# EAGLE design FinalSchematic1.0 (EAGLE 9.6.2)
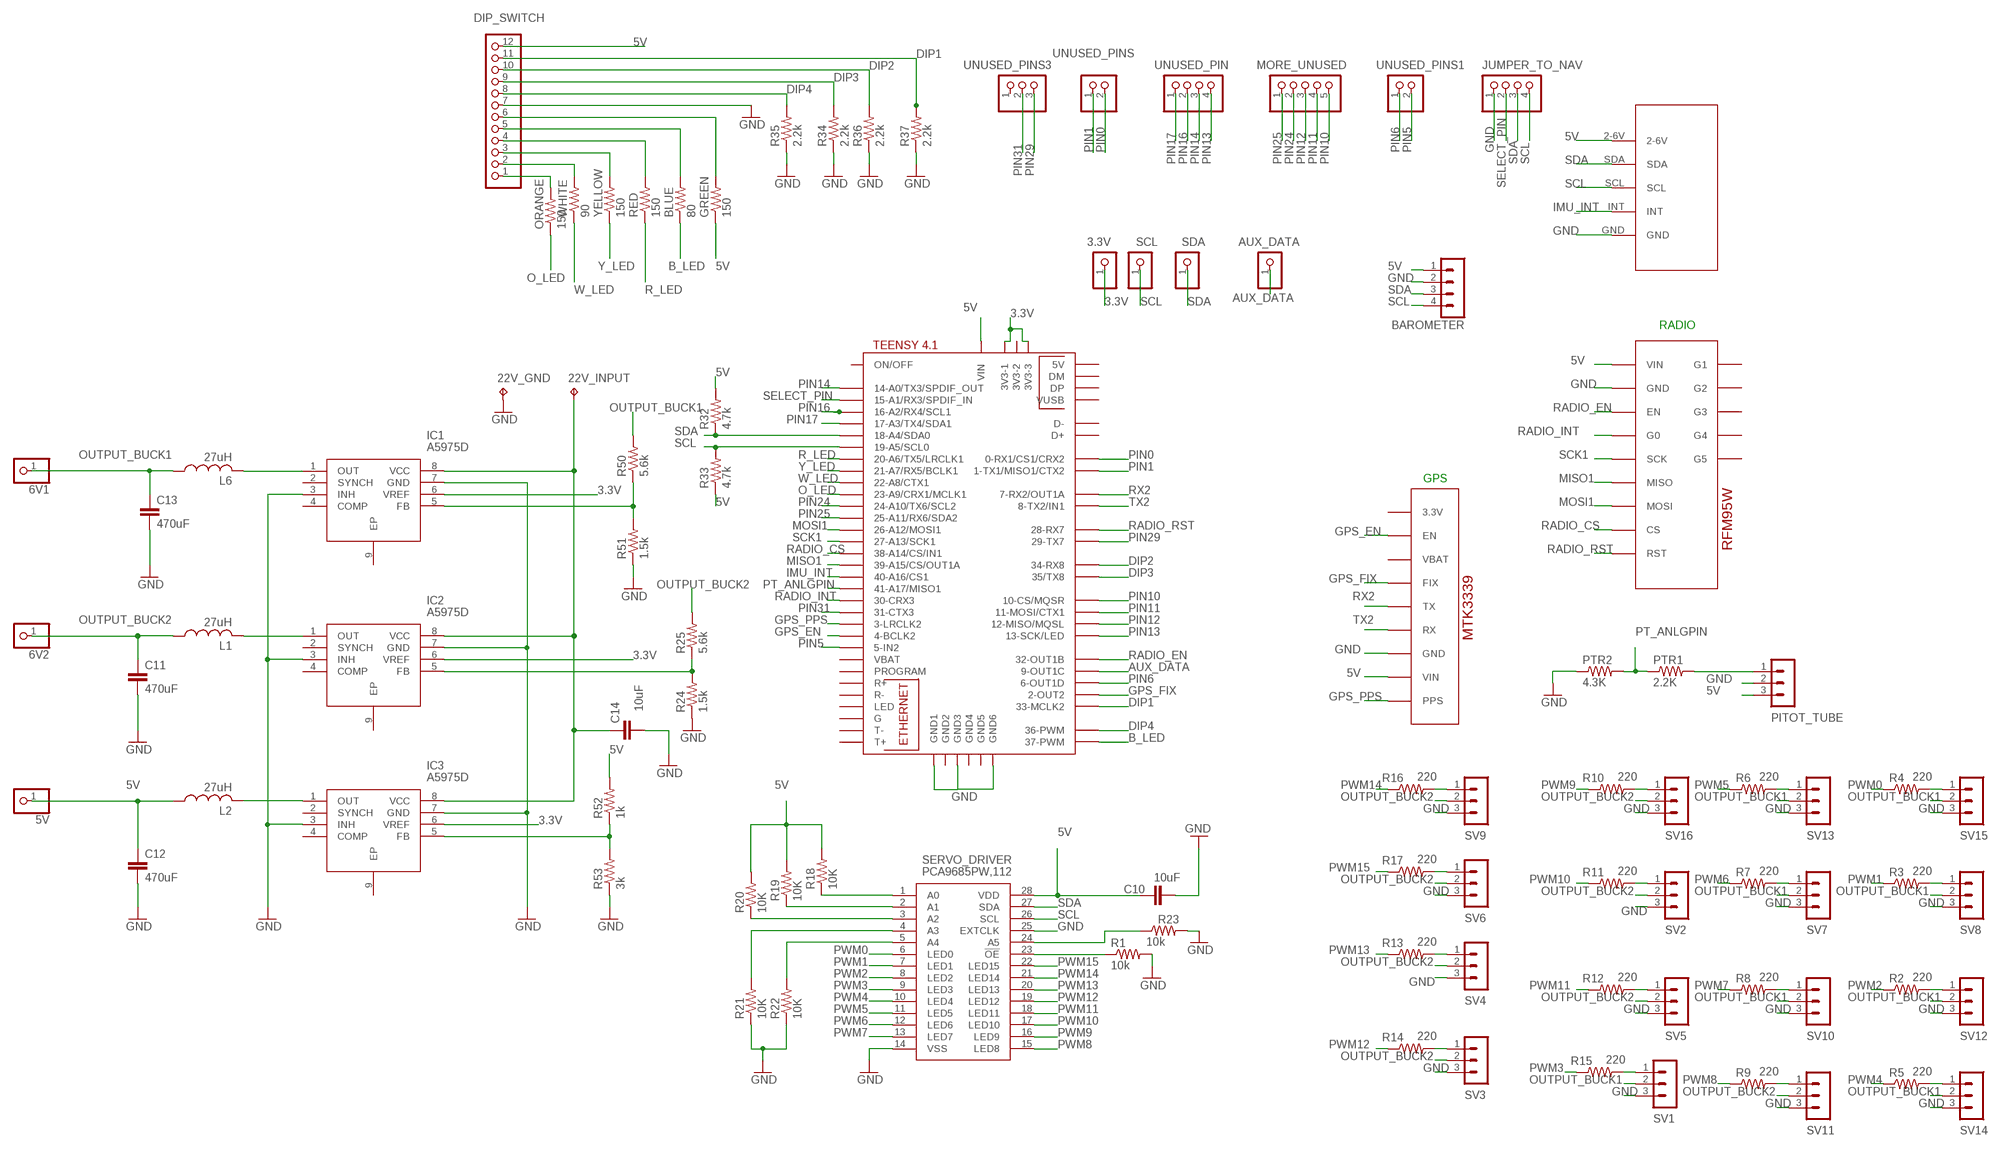
[diagram p0: schematic, sheet 1]

## Parts
3.3V  PINHD-1X1  [1X01]
5V  PINHD-1X1  [1X01]
6V1  PINHD-1X1  [1X01]
6V2  PINHD-1X1  [1X01]
22V_GND  TPPAD1-17Y  [P1-17Y]
22V_INPUT  TPPAD1-17Y  [P1-17Y]
AUX_DATA  PINHD-1X1  [1X01]
BAROMETER  MA04-1  [MA04-1]
BLUE  80  R-US_0204/7  [0204/7]
C10  10uF  C2,5-3  [C2.5-3]
C11  470uF  C2,5-3  [C2.5-3]
C12  470uF  C2,5-3  [C2.5-3]
C13  470uF  C2,5-3  [C2.5-3]
C14  10uF  C2,5-3  [C2.5-3]
DIP_SWITCH  PINHD-1X12  [1X12]
GPSMTK3339  ADAFRUIT_MTK3339_GPS  [ADAFRUIT_MTK3339_GPS]
GREEN  150  R-US_0204/7  [0204/7]
IC1  A5975D  [SOIC127P600X170-9N]
IC2  A5975D  [SOIC127P600X170-9N]
IC3  A5975D  [SOIC127P600X170-9N]
JUMPER_TO_NAV  PINHD-1X4  [1X04]
L1  27uH  L-USTFI0307  [TFI0307]
L2  27uH  L-USTFI0307  [TFI0307]
L6  27uH  L-USTFI0307  [TFI0307]
MORE_UNUSED  PINHD-1X5  [1X05]
ORANGE  150  R-US_0204/7  [0204/7]
PITOT_TUBE  MA03-1  [MA03-1]
PTR1  2.2K  R-US_0204/7  [0204/7]
PTR2  4.3K  R-US_0204/7  [0204/7]
R1  10k  R-US_0204/7  [0204/7]
R2  220  R-US_0204/7  [0204/7]
R3  220  R-US_0204/7  [0204/7]
R4  220  R-US_0204/7  [0204/7]
R5  220  R-US_0204/7  [0204/7]
R6  220  R-US_0204/7  [0204/7]
R7  220  R-US_0204/7  [0204/7]
R8  220  R-US_0204/7  [0204/7]
R9  220  R-US_0204/7  [0204/7]
R10  220  R-US_0204/7  [0204/7]
R11  220  R-US_0204/7  [0204/7]
R12  220  R-US_0204/7  [0204/7]
R13  220  R-US_0204/7  [0204/7]
R14  220  R-US_0204/7  [0204/7]
R15  220  R-US_0204/7  [0204/7]
R16  220  R-US_0204/7  [0204/7]
R17  220  R-US_0204/7  [0204/7]
R18  10K  R-US_0204/7  [0204/7]
R19  10K  R-US_0204/7  [0204/7]
R20  10K  R-US_0204/7  [0204/7]
R21  10K  R-US_0204/7  [0204/7]
R22  10K  R-US_0204/7  [0204/7]
R23  10k  R-US_0204/7  [0204/7]
R24  1.5k  R-US_0204/7  [0204/7]
R25  5.6k  R-US_0204/7  [0204/7]
R32  4.7k  R-US_0204/7  [0204/7]
R33  4.7k  R-US_0204/7  [0204/7]
R34  2.2k  R-US_0204/7  [0204/7]
R35  2.2k  R-US_0204/7  [0204/7]
R36  2.2k  R-US_0204/7  [0204/7]
R37  2.2k  R-US_0204/7  [0204/7]
R50  5.6k  R-US_0204/7  [0204/7]
R51  1.5k  R-US_0204/7  [0204/7]
R52  1k  R-US_0204/7  [0204/7]
R53  3k  R-US_0204/7  [0204/7]
RADIO  ADAFRUIT_RFM95W_LORA_RADIO  [ADAFRUIT_RFM95W_LORA_RADIO]
RED  150  R-US_0204/7  [0204/7]
SCL  PINHD-1X1  [1X01]
SDA  PINHD-1X1  [1X01]
SERVO_DRIVER  PCA9685PW,112  [SOP65P640X110-28N]
SV1  MA03-1  [MA03-1]
SV2  MA03-1  [MA03-1]
SV3  MA03-1  [MA03-1]
SV4  MA03-1  [MA03-1]
SV5  MA03-1  [MA03-1]
SV6  MA03-1  [MA03-1]
SV7  MA03-1  [MA03-1]
SV8  MA03-1  [MA03-1]
SV9  MA03-1  [MA03-1]
SV10  MA03-1  [MA03-1]
SV11  MA03-1  [MA03-1]
SV12  MA03-1  [MA03-1]
SV13  MA03-1  [MA03-1]
SV14  MA03-1  [MA03-1]
SV15  MA03-1  [MA03-1]
SV16  MA03-1  [MA03-1]
TEENSY4.1  TEENSY41  [TEENSY41]
U$2  ICM20948BREAKOUTDEVICE  [ICM20948BREAKOUT]
UNUSED_PIN  PINHD-1X4  [1X04]
UNUSED_PINS  PINHD-1X2  [1X02]
UNUSED_PINS1  PINHD-1X2  [1X02]
UNUSED_PINS3  PINHD-1X3  [1X03]
WHITE  90  R-US_0204/7  [0204/7]
YELLOW  150  R-US_0204/7  [0204/7]

## Nets
3.3V: 3.3V.1 IC1.6(VREF) IC2.6(VREF) IC3.6(VREF) TEENSY4.1.3V3-1 TEENSY4.1.3V3-3
5V: 5V.1 BAROMETER.1 C10.1 C12.1 DIP_SWITCH.12 GPSMTK3339.VIN GREEN.1 L2.1 PITOT_TUBE.3 R18.2 R19.2 R20.2 R32.2 R33.1 R52.2 RADIO.1(VIN) SERVO_DRIVER.28(VDD) TEENSY4.1.VIN U$2.2-6V
AUX_DATA: AUX_DATA.1 TEENSY4.1.9-OUT1C
B_LED: BLUE.1 TEENSY4.1.37-PWM
DIP1: DIP_SWITCH.11 R37.2 TEENSY4.1.33-MCLK2
DIP2: DIP_SWITCH.10 R36.2 TEENSY4.1.34-RX8
DIP3: DIP_SWITCH.9 R34.2 TEENSY4.1.35-TX8(35/TX8)
DIP4: DIP_SWITCH.8 R35.2 TEENSY4.1.36-PWM
GND: 22V_GND.TP BAROMETER.2 C10.2 C11.2 C12.2 C13.2 C14.2 DIP_SWITCH.7 GPSMTK3339.GND IC1.3(INH) IC1.7(GND) IC2.3(INH) IC2.7(GND) IC3.3(INH) IC3.7(GND) JUMPER_TO_NAV.1 PITOT_TUBE.2 PTR2.1 R1.2 R21.1 R22.1 R23.2 R24.1 R34.1 R35.1 R36.1 R37.1 R51.1 R53.1 RADIO.2(GND) SERVO_DRIVER.14(VSS) SERVO_DRIVER.25(EXTCLK) SV1.3 SV2.3 SV3.3 SV4.3 SV5.3 SV6.3 SV7.3 SV8.3 SV9.3 SV10.3 SV11.3 SV12.3 SV13.3 SV14.3 SV15.3 SV16.3 TEENSY4.1.GND1 TEENSY4.1.GND3 TEENSY4.1.GND6 U$2.GND
GPS_EN: GPSMTK3339.EN TEENSY4.1.4-BCLK2
GPS_FIX: GPSMTK3339.FIX TEENSY4.1.2-OUT2
GPS_PPS: GPSMTK3339.PPS TEENSY4.1.3-LRCLK2
IMU_INT: TEENSY4.1.40-A16/CS1 U$2.INT
MISO1: RADIO.6(MISO) TEENSY4.1.39-A15/CS/OUT1A
MOSI1: RADIO.7(MOSI) TEENSY4.1.26-A12/MOSI1
N$1: DIP_SWITCH.4 RED.2
N$2: R14.2 SV3.1
N$3: BLUE.2 DIP_SWITCH.5
N$4: PITOT_TUBE.1 PTR1.2
N$5: 22V_INPUT.TP C14.1 IC1.8(VCC) IC2.8(VCC) IC3.8(VCC)
N$6: IC3.1(OUT) L2.2
N$7: DIP_SWITCH.6 GREEN.2
N$8: IC1.1(OUT) L6.2
N$9: IC1.5(FB) R50.1 R51.2
N$10: DIP_SWITCH.3 YELLOW.2
N$11: DIP_SWITCH.2 WHITE.2
N$12: IC2.1(OUT) L1.2
N$14: R23.1 SERVO_DRIVER.24(A5)
N$15: R1.1 SERVO_DRIVER.23(!OE)
N$16: DIP_SWITCH.1 ORANGE.2
N$18: IC3.5(FB) R52.1 R53.2
N$19: IC2.5(FB) R24.2 R25.1
N$43: R10.2 SV16.1
N$72: R22.2 SERVO_DRIVER.5(A4)
N$73: R21.2 SERVO_DRIVER.4(A3)
N$74: R20.1 SERVO_DRIVER.3(A2)
N$75: R19.1 SERVO_DRIVER.2(A1)
N$76: R18.1 SERVO_DRIVER.1(A0)
N$81: R6.2 SV13.1
N$82: R4.2 SV15.1
N$85: R3.2 SV8.1
N$88: R7.2 SV7.1
N$91: R11.2 SV2.1
N$94: R15.2 SV1.1
N$97: R2.2 SV12.1
N$100: R5.2 SV14.1
N$105: R9.2 SV11.1
N$108: R8.2 SV10.1
N$109: R12.2 SV5.1
N$112: R16.2 SV9.1
N$115: R17.2 SV6.1
N$118: R13.2 SV4.1
O_LED: ORANGE.1 TEENSY4.1.23-A9/CRX1/MCLK1
OUTPUT_BUCK1: 6V1.1 C13.1 L6.1 R50.2 SV1.2 SV7.2 SV8.2 SV10.2 SV12.2 SV13.2 SV14.2 SV15.2
OUTPUT_BUCK2: 6V2.1 C11.1 L1.1 R25.2 SV2.2 SV3.2 SV4.2 SV5.2 SV6.2 SV9.2 SV11.2 SV16.2
PIN0: TEENSY4.1.0-RX1/CS1/CRX2 UNUSED_PINS.2
PIN1: TEENSY4.1.1-TX1/MISO1/CTX2 UNUSED_PINS.1
PIN5: TEENSY4.1.5-IN2 UNUSED_PINS1.2
PIN6: TEENSY4.1.6-OUT1D UNUSED_PINS1.1
PIN10: MORE_UNUSED.5 TEENSY4.1.10-CS\MQSR(10-CS/MQSR)
PIN11: MORE_UNUSED.4 TEENSY4.1.11-MOSI/CTX1
PIN12: MORE_UNUSED.3 TEENSY4.1.12-MISO/MQSL
PIN13: TEENSY4.1.13-SCK/LED UNUSED_PIN.4
PIN14: TEENSY4.1.14-A0/TX3/SPDIF_OUT UNUSED_PIN.3
PIN16: TEENSY4.1.16-A2/RX4/SCL1 UNUSED_PIN.2
PIN17: TEENSY4.1.17-A3/TX4/SDA1 UNUSED_PIN.1
PIN24: MORE_UNUSED.2 TEENSY4.1.24-A10/TX6/SCL2
PIN25: MORE_UNUSED.1 TEENSY4.1.25-A11/RX6/SDA2
PIN29: TEENSY4.1.29-TX7 UNUSED_PINS3.3
PIN31: TEENSY4.1.31-CTX3 UNUSED_PINS3.2
PT_ANLGPIN: PTR1.1 PTR2.2 TEENSY4.1.41-A17/MISO1
PWM0: R4.1 SERVO_DRIVER.6(LED0)
PWM1: R3.1 SERVO_DRIVER.7(LED1)
PWM2: R2.1 SERVO_DRIVER.8(LED2)
PWM3: R15.1 SERVO_DRIVER.9(LED3)
PWM4: R5.1 SERVO_DRIVER.10(LED4)
PWM5: R6.1 SERVO_DRIVER.11(LED5)
PWM6: R7.1 SERVO_DRIVER.12(LED6)
PWM7: R8.1 SERVO_DRIVER.13(LED7)
PWM8: R9.1 SERVO_DRIVER.15(LED8)
PWM9: R10.1 SERVO_DRIVER.16(LED9)
PWM10: R11.1 SERVO_DRIVER.17(LED10)
PWM11: R12.1 SERVO_DRIVER.18(LED11)
PWM12: R14.1 SERVO_DRIVER.19(LED12)
PWM13: R13.1 SERVO_DRIVER.20(LED13)
PWM14: R16.1 SERVO_DRIVER.21(LED14)
PWM15: R17.1 SERVO_DRIVER.22(LED15)
R_LED: RED.1 TEENSY4.1.20-A6/TX5/LRCLK1
RADIO_CS: RADIO.8(CS) TEENSY4.1.38-A14/CS/IN1
RADIO_EN: RADIO.3(EN) TEENSY4.1.32-OUT1B
RADIO_INT: RADIO.4(G0) TEENSY4.1.30-CRX3
RADIO_RST: RADIO.9(RST) TEENSY4.1.28-RX7
RX2: GPSMTK3339.TX TEENSY4.1.7-RX2/OUT1A
SCK1: RADIO.5(SCK) TEENSY4.1.27-A13/SCK1
SCL: BAROMETER.4 JUMPER_TO_NAV.4 R33.2 SCL.1 SERVO_DRIVER.26(SCL) TEENSY4.1.19-A5/SCL0 U$2.SCL
SDA: BAROMETER.3 JUMPER_TO_NAV.3 R32.1 SDA.1 SERVO_DRIVER.27(SDA) TEENSY4.1.18-A4/SDA0 U$2.SDA
SELECT_PIN: JUMPER_TO_NAV.2 TEENSY4.1.15-A1/RX3/SPDIF_IN
TX2: GPSMTK3339.RX TEENSY4.1.8-TX2/IN1
W_LED: TEENSY4.1.22-A8/CTX1 WHITE.1
Y_LED: TEENSY4.1.21-A7/RX5/BCLK1 YELLOW.1
Unconnected: GPSMTK3339.3.3V GPSMTK3339.VBAT IC1.2(SYNCH) IC1.4(COMP) IC1.9(EP) IC2.2(SYNCH) IC2.4(COMP) IC2.9(EP) IC3.2(SYNCH) IC3.4(COMP) IC3.9(EP) RADIO.10(G1) RADIO.11(G2) RADIO.12(G3) RADIO.13(G4) RADIO.14(G5) TEENSY4.1.3V3-2 TEENSY4.1.+5V(5V) TEENSY4.1.D+ TEENSY4.1.D- TEENSY4.1.DM TEENSY4.1.DP TEENSY4.1.G TEENSY4.1.GND2 TEENSY4.1.GND4 TEENSY4.1.GND5 TEENSY4.1.LED TEENSY4.1.ON/OFF TEENSY4.1.PROGRAM TEENSY4.1.R+ TEENSY4.1.R- TEENSY4.1.T+ TEENSY4.1.T- TEENSY4.1.VBAT TEENSY4.1.VUSB UNUSED_PINS3.1

## Notes on the sheet
- RADIO
- GPS

## Library data of the parts
3.3V 5V 6V1 6V2 AUX_DATA SCL SDA = pinhead:PINHD-1X1: PIN HEADER
22V_GND 22V_INPUT = testpad:TP: Test pad
BAROMETER = con-lstb:MA04-1: PIN HEADER; OC_FARNELL: unknown; OC_NEWARK: unknown
BLUE GREEN ORANGE PTR1 PTR2 R1-R25 R32-R37 R50-R53 RED WHITE YELLOW = adafruit:R-US_: RESISTOR, American symbol
C10-C14 = capacitor-wima:C: CAPACITOR naming: grid - package width
DIP_SWITCH = pinhead:PINHD-1X12: PIN HEADER
GPSMTK3339 = AERO_Eagle_Library:ADAFRUIT_MTK3339_GPS: Adafruit's Ultimate GPS Breakout: MTK3339 https://www.adafruit.com/product/746
IC1-IC3 = A5975D:A5975D: STMICROELECTRONICS - A5975D - DC/DC Boost Regulator, Adjustable, AEC-Q100, 4V to 36V In, 1.235V to 35V/3A Out, 250 kHz, PowerSO-8 Source: Datasheet <https://www.st.com/resource/en/datasheet/a5975d.pdf>; ARROW_PART_NUMBER: A5975D; ARROW_PRICE-STOCK: https://www.arrow.com/en/products/a5975d/stmicroelectronics; DESCRIPTION: STMICROELECTRONICS - A5975D - DC/DC Boost Regulator, Adjustable, AEC-Q100, 4V to 36V In, 1.235V to 35V/3A Out, 250 kHz, PowerSO-8; HEIGHT: 1.7mm; MANUFACTURER_NAME: STMicroelectronics; MANUFACTURER_PART_NUMBER: A5975D; MOUSER_PART_NUMBER: 511-A5975D; MOUSER_PRICE-STOCK: https://www.mouser.co.uk/ProductDetail/STMicroelectronics/A5975D?qs=LYO3r17CQdO66PebjUe%2FOA%3D%3D
JUMPER_TO_NAV UNUSED_PIN = pinhead:PINHD-1X4: PIN HEADER
L1 L2 L6 = rcl:L-US: INDUCTOR, American symbol; SPICEPREFIX: L
MORE_UNUSED = pinhead:PINHD-1X5: PIN HEADER
PITOT_TUBE SV1-SV16 = con-lstb:MA03-1: PIN HEADER; OC_FARNELL: unknown; OC_NEWARK: unknown
RADIO = AERO_Eagle_Library:ADAFRUIT_RFM95W_LORA_RADIO: Adafruit's LoRa Radio: RFM95W https://www.adafruit.com/product/3072
SERVO_DRIVER = PCA9685PW_112:PCA9685PW,112: 16-channel, 12-bit PWM Fm+ I2C-bus LED controller Source: Datasheet <http://www.nxp.com/docs/en/data-sheet/PCA9685.pdf>; ARROW_PART_NUMBER: PCA9685PW,112; ARROW_PRICE-STOCK: https://www.arrow.com/en/products/pca9685pw112/nxp-semiconductors; DESCRIPTION: 16-channel, 12-bit PWM Fm+ I2C-bus LED controller; HEIGHT: 1.1mm; MANUFACTURER_NAME: NXP; MANUFACTURER_PART_NUMBER: PCA9685PW,112; MOUSER_PART_NUMBER: 771-PCA9685PW,112; MOUSER_PRICE-STOCK: https://www.mouser.co.uk/ProductDetail/NXP-Semiconductors/PCA9685PW112/?qs=6YAT8rHPFU9wZqiAeiOMZw%3D%3D
TEENSY4.1 = teensy:TEENSY41
U$2 = ICM20948 BREAKOUT:ICM20948BREAKOUTDEVICE
UNUSED_PINS UNUSED_PINS1 = pinhead:PINHD-1X2: PIN HEADER
UNUSED_PINS3 = pinhead:PINHD-1X3: PIN HEADER

## Board
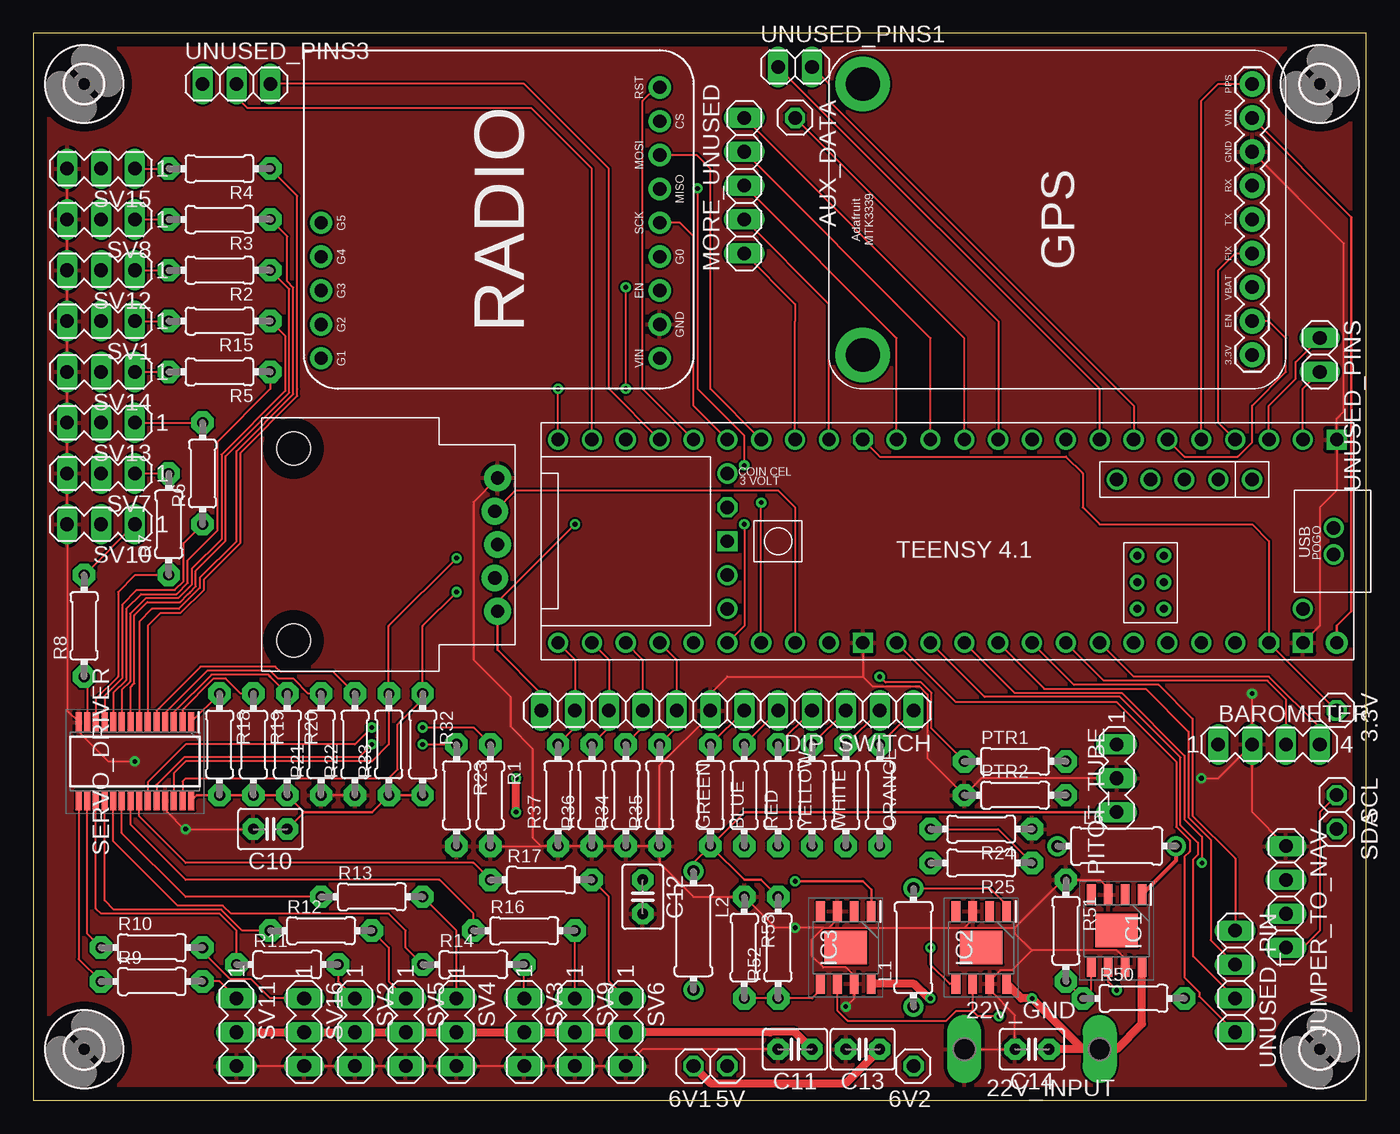
[diagram p1: board, top side]
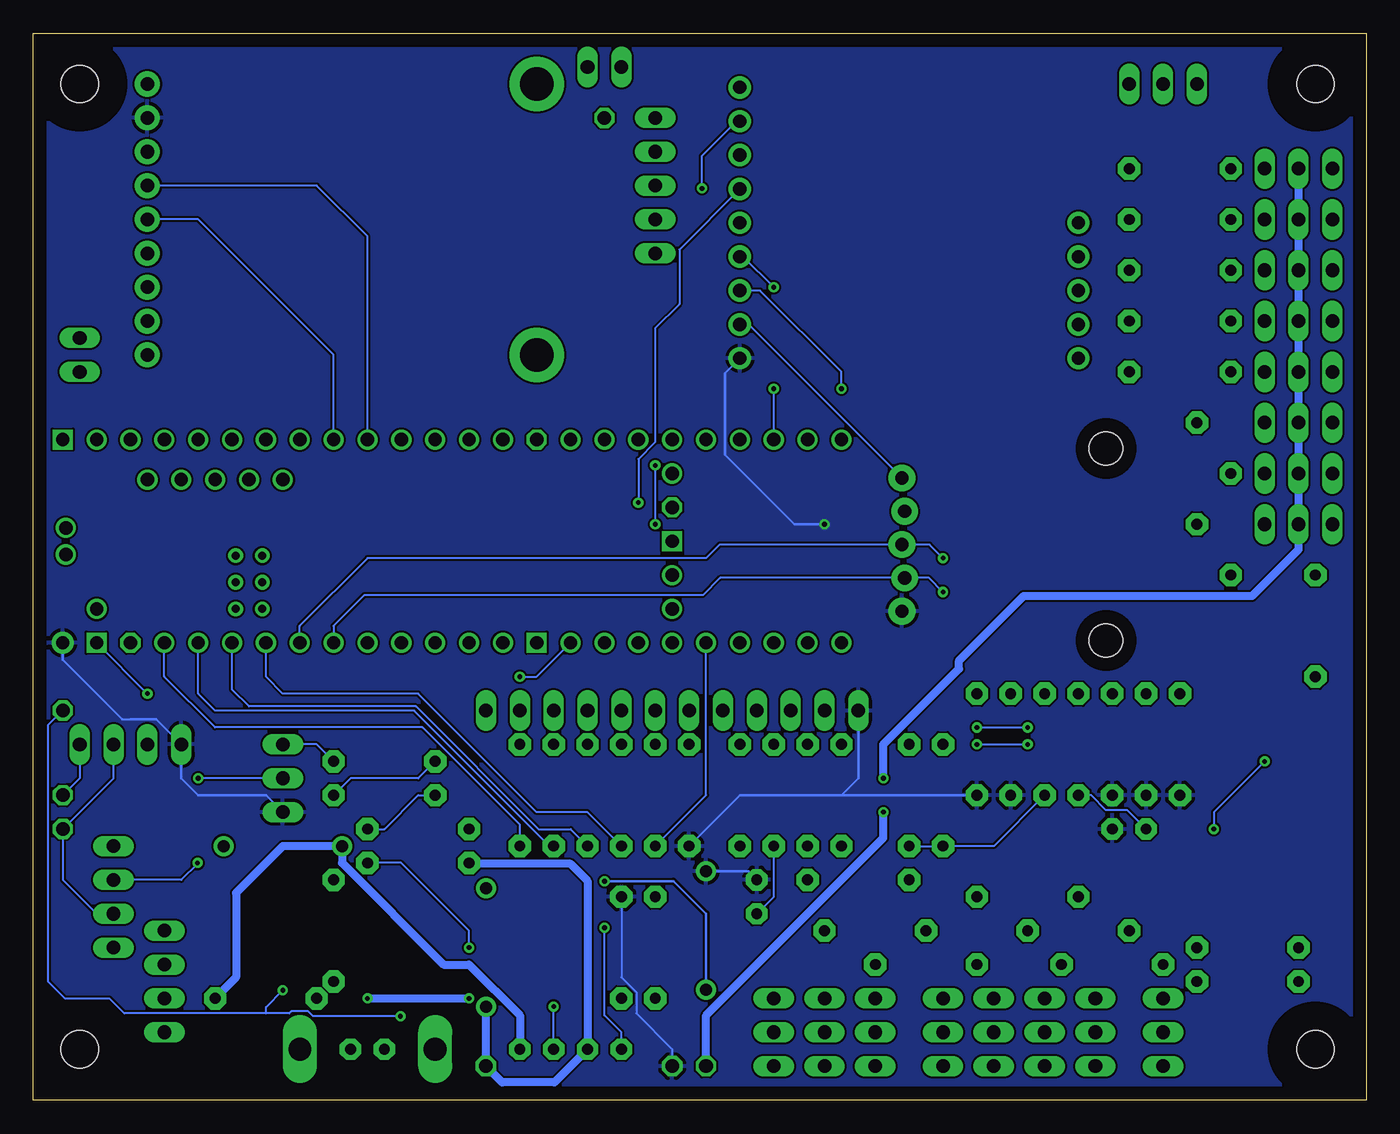
[diagram p2: board, bottom side, seen from below]

Size 100 x 80 mm. Coordinates in mm from the lower left corner, seen from the top.
Outline: 0,0 100,0 100,80 0,80 0,0
Copper layers (1*16): Top 0.035mm / dielectric 1.5mm / Bottom 0.035mm
Design rules "default *": minimum track width 6mil, minimum drill 0.35mm, track to track 6mil, track to pad 8mil, pad to pad 6mil, via to via 8mil, smd to smd 6mil, copper to edge 40mil, drill to drill 6mil, minimum pad ring 10mil, minimum via ring 8mil, stop-mask expansion 4mil, vias tented up to drill 0mil, thermal gap 10mil

### Footprints (pad centres in the part's own frame; a part is rotated, then mirrored left to right if it is on the bottom)
1X01 = drill 1.016 octagon: 1 0,0
P1-17Y = drill 1.702 pad 2.121 long: TP 0,0
MA04-1 = drill 1.016 long: 1 -3.81,0; 2 -1.27,0; 3 1.27,0; 4 3.81,0
0204/7 = drill 0.813 pad 1.676 octagon: 1 -3.81,0; 2 3.81,0
C2.5-3 = drill 0.813 pad 1.6 octagon: 1 -1.27,0; 2 1.27,0
1X12 = drill 1.016 long: 1 -13.97,0; 2 -11.43,0; 3 -8.89,0; 4 -6.35,0; 5 -3.81,0; 6 -1.27,0; 7 1.27,0; 8 3.81,0; 9 6.35,0; 10 8.89,0; 11 11.43,0; 12 13.97,0
ADAFRUIT_MTK3339_GPS = drill 1.016 pad 1.88: 3.3V 2.54,2.54; EN 5.08,2.54; FIX 10.16,2.54; GND 17.78,2.54; PPS 22.86,2.54; RX 15.24,2.54; TX 12.7,2.54; VBAT 7.62,2.54; VIN 20.32,2.54 | drill 2.54 pad 4.064: P$1 22.86,31.75; P$2 2.54,31.75
SOIC127P600X170-9N = smd 1.525 x 0.65: 1 -2.712,1.905; 2 -2.712,0.635; 3 -2.712,-0.635; 4 -2.712,-1.905; 5 2.712,-1.905; 6 2.712,-0.635; 7 2.712,0.635; 8 2.712,1.905 | smd 2.51 x 3.2: 9 0,0
1X04 = drill 1.016 long: 1 -3.81,0; 2 -1.27,0; 3 1.27,0; 4 3.81,0
TFI0307 = drill 0.9 pad 1.5: 1 -4.445,0; 2 4.445,0
1X05 = drill 1.016 long: 1 -5.08,0; 2 -2.54,0; 3 0,0; 4 2.54,0; 5 5.08,0
MA03-1 = drill 1.016 long: 1 -2.54,0; 2 0,0; 3 2.54,0
ADAFRUIT_RFM95W_LORA_RADIO = drill 1 pad 1.676: 1 2.29,-26.67; 2 4.83,-26.67; 3 7.37,-26.67; 4 9.91,-26.67; 5 12.45,-26.67; 6 14.99,-26.67; 7 17.53,-26.67; 8 20.07,-26.67; 9 22.61,-26.67; 10 2.29,-1.27; 11 4.83,-1.27; 12 7.37,-1.27; 13 9.91,-1.27; 14 12.45,-1.27
SOP65P640X110-28N = smd 1.475 x 0.45: 1 -2.938,4.225; 2 -2.938,3.575; 3 -2.938,2.925; 4 -2.938,2.275; 5 -2.938,1.625; 6 -2.938,0.975; 7 -2.938,0.325; 8 -2.938,-0.325; 9 -2.938,-0.975; 10 -2.938,-1.625; 11 -2.938,-2.275; 12 -2.938,-2.925; 13 -2.938,-3.575; 14 -2.938,-4.225; 15 2.938,-4.225; 16 2.938,-3.575; 17 2.938,-2.925; 18 2.938,-2.275; 19 2.938,-1.625; 20 2.938,-0.975; 21 2.938,-0.325; 22 2.938,0.325; 23 2.938,0.975; 24 2.938,1.625; 25 2.938,2.275; 26 2.938,2.925; 27 2.938,3.575; 28 2.938,4.225
TEENSY41 = drill 1: 0-RX1/CS1/CRX2 -27.94,-7.62; 1-TX1/MISO1/CTX2 -25.4,-7.62; 2-OUT2 -22.86,-7.62; 3-LRCLK2 -20.32,-7.62; 4-BCLK2 -17.78,-7.62; 5-IN2 -15.24,-7.62; 6-OUT1D -12.7,-7.62; 7-RX2/OUT1A -10.16,-7.62; 8-TX2/IN1 -7.62,-7.62; 9-OUT1C -5.08,-7.62; 10-CS\MQSR -2.54,-7.62; 11-MOSI/CTX1 0,-7.62; 12-MISO/MQSL 2.54,-7.62; 13-SCK/LED 2.54,7.62; 14-A0/TX3/SPDIF_OUT 0,7.62; 15-A1/RX3/SPDIF_IN -2.54,7.62; 16-A2/RX4/SCL1 -5.08,7.62; 17-A3/TX4/SDA1 -7.62,7.62; 18-A4/SDA0 -10.16,7.62; 19-A5/SCL0 -12.7,7.62; 20-A6/TX5/LRCLK1 -15.24,7.62; 21-A7/RX5/BCLK1 -17.78,7.62; 22-A8/CTX1 -20.32,7.62; 23-A9/CRX1/MCLK1 -22.86,7.62; 24-A10/TX6/SCL2 7.62,-7.62; 25-A11/RX6/SDA2 10.16,-7.62; 26-A12/MOSI1 12.7,-7.62; 27-A13/SCK1 15.24,-7.62; 28-RX7 17.78,-7.62; 29-TX7 20.32,-7.62; 30-CRX3 22.86,-7.62; 31-CTX3 25.4,-7.62; 32-OUT1B 27.94,-7.62; 33-MCLK2 27.94,7.62; 34-RX8 25.4,7.62; 35-TX8 22.86,7.62; 36-PWM 20.32,7.62; 37-PWM 17.78,7.62; 38-A14/CS/IN1 15.24,7.62; 39-A15/CS/OUT1A 12.7,7.62; 40-A16/CS1 10.16,7.62; 41-A17/MISO1 7.62,7.62; +5V -24.13,-4.62; D+ -30.25,-1; D- -30.25,1; DM -21.59,-4.62; DP -19.05,-4.62; GND4 -16.51,-4.62; GND5 -13.97,-4.62; ON/OFF 15.24,5.08; PROGRAM 15.24,2.54; VBAT 15.24,-5.08; VUSB -27.94,5.08 | drill 1 octagon: 3V3-1 5.08,-7.62; 3V3-2 15.24,-2.54; 3V3-3 -25.4,7.62 | drill 0.6: G -15.51,3.08; LED -17.51,3.08; R+ -17.51,5.08; R- -15.51,5.08; T+ -15.51,1.08; T- -17.51,1.08 | drill 1 square: GND1 -30.48,-7.62; GND2 15.24,0; GND3 5.08,7.62; GND6 -27.94,7.62 | drill 1 pad 1.676: VIN -30.48,7.62
2,8 = hole 2.8: 0,0
ICM20948BREAKOUT = drill 1 pad 2: 2-6V -5.254,-9.427; GND 4.746,-9.427; INT 2.246,-9.227; SCL -0.254,-9.427; SDA -2.754,-9.227 | hole 2.5: -7.454,5.873; 6.946,5.873
1X02 = drill 1.016 long: 1 -1.27,0; 2 1.27,0
1X03 = drill 1.016 long: 1 -2.54,0; 2 0,0; 3 2.54,0

### Placement (x,y rotation side)
3.3V  97.79,29.21 270 top
5V  52.07,2.54 180 top
6V1  49.53,2.54 180 top
6V2  66.04,2.54 180 top
22V_GND  69.85,3.81 0 top
22V_INPUT  80.01,3.81 180 top
AUX_DATA  57.15,73.66 270 top
BAROMETER  92.71,26.67 0 top
BLUE  53.34,22.86 90 top
C10  17.78,20.32 180 top
C11  57.15,3.81 180 top
C12  45.72,15.24 270 top
C13  62.23,3.81 180 top
C14  74.93,3.81 180 top
DIP_SWITCH  52.07,29.21 180 top
GPSMTK3339  93.98,53.34 90 top
GREEN  50.8,22.86 90 top
IC1  81.28,12.7 270 top
IC2  71.12,11.43 270 top
IC3  60.96,11.43 270 top
JUMPER_TO_NAV  93.98,15.24 270 top
L1  66.04,11.43 90 top
L2  49.53,12.7 270 top
L6  81.28,19.05 0 top
MORE_UNUSED  53.34,68.58 90 top
ORANGE  63.5,22.86 90 top
PITOT_TUBE  81.28,24.13 270 top
PTR1  73.66,25.4 0 top
PTR2  73.66,22.86 0 top
R1  34.29,22.86 270 top
R2  13.97,62.23 180 top
R3  13.97,66.04 180 top
R4  13.97,69.85 180 top
R5  13.97,54.61 180 top
R6  12.7,46.99 90 top
R7  10.16,43.18 90 top
R8  3.81,35.56 90 top
R9  8.89,8.89 0 top
R10  8.89,11.43 0 top
R11  19.05,10.16 0 top
R12  21.59,12.7 0 top
R13  25.4,15.24 0 top
R14  33.02,10.16 0 top
R15  13.97,58.42 180 top
R16  36.83,12.7 0 top
R17  38.1,16.51 0 top
R18  13.97,26.67 270 top
R19  16.51,26.67 270 top
R20  19.05,26.67 270 top
R21  21.59,26.67 90 top
R22  24.13,26.67 90 top
R23  31.75,22.86 270 top
R24  71.12,20.32 180 top
R25  71.12,17.78 180 top
R32  29.21,26.67 270 top
R33  26.67,26.67 90 top
R34  44.45,22.86 90 top
R35  46.99,22.86 90 top
R36  41.91,22.86 90 top
R37  39.37,22.86 90 top
R50  82.55,7.62 0 top
R51  77.47,12.7 270 top
R52  55.88,11.43 90 top
R53  53.34,11.43 270 top
RADIO  20.32,53.34 90 top
RED  55.88,22.86 90 top
SCL  97.79,22.86 270 top
SDA  97.79,20.32 270 top
SERVO_DRIVER  7.62,25.4 270 top
SV1  5.08,58.42 180 top
SV2  24.13,5.08 270 top
SV3  36.83,5.08 270 top
SV4  31.75,5.08 270 top
SV5  27.94,5.08 270 top
SV6  44.45,5.08 270 top
SV7  5.08,46.99 180 top
SV8  5.08,66.04 180 top
SV9  40.64,5.08 270 top
SV10  5.08,43.18 180 top
SV11  15.24,5.08 270 top
SV12  5.08,62.23 180 top
SV13  5.08,50.8 180 top
SV14  5.08,54.61 180 top
SV15  5.08,69.85 180 top
SV16  20.32,5.08 270 top
TEENSY4.1  67.31,41.91 180 top
U$1  [2,8]  3.81,76.2 0 top
U$2  25.4,41.91 90 top
U$3  [2,8]  96.52,76.2 0 top
U$4  [2,8]  3.81,3.81 0 top
U$5  [2,8]  96.52,3.81 0 top
UNUSED_PIN  90.17,8.89 270 top
UNUSED_PINS  96.52,55.88 270 top
UNUSED_PINS1  57.15,77.47 0 top
UNUSED_PINS3  15.24,76.2 0 top
WHITE  60.96,22.86 90 top
YELLOW  58.42,22.86 90 top

### Tracks (layer width: path | path; a pad name or v marks a point on that pad's centre or on a via)
3.3V  (via drill 0.35)
  Top 0.152: 3.3V.1 TEENSY4.1.3V3-3 92.71,41.91 91.44,43.18 80.01,43.18 78.74,44.45 78.74,46.99 77.47,48.26 63.5,48.26 TEENSY4.1.3V3-1 | v81.28,8.23 80.64,8.87 IC1.6 | v72.46,6.28 70.85,6.28 70.49,6.64 | 70.49,6.64 69.21,6.64 68.52,5.96 61.08,5.96 60.3,6.74 60.3,8.55 60.33,8.57 IC3.6 | 70.49,6.64 70.48,6.65 IC2.6
  Bottom 0.152: 82.55,6.5 80.79,6.5 80.65,6.64 79.37,6.64 79.01,6.28 v72.46,6.28 | 82.55,6.5 93.17,6.5 94.29,7.62 97.64,7.62 98.91,8.89 98.91,28.09 3.3V.1 | 82.55,6.5 82.55,6.96 v81.28,8.23
5V  (via drill 0.35)
  Top 0.203: R52.2 54.61,16.51 53.34,16.51 GREEN.1 | PITOT_TUBE.3 53.34,21.59 GREEN.1 | GPSMTK3339.VIN 98.88,66.22 98.88,36.65 97.79,35.56 TEENSY4.1.VIN | v40.64,43.18 34.83,37.37 U$2.2-6V 34.83,33.75 38.1,30.48 DIP_SWITCH.12 | R32.2 R33.1 25.4,21.59 20.32,21.59 | C10.1 20.32,21.59 | 20.32,21.59 R20.2 R19.2 R18.2 12.24,22.86 SERVO_DRIVER.28 | GREEN.1 49.53,17.78 L2.1
  Bottom 0.152: 93.32,28.55 92.71,28.55 | 5V.1 52.07,3.81 54.76,6.5 54.76,8.08 55.88,9.2 R52.2
  Bottom 0.203: TEENSY4.1.VIN 97.79,33.02 93.32,28.55 | 92.71,28.55 90.78,28.55 BAROMETER.1 88.9,24.13 87.63,22.86 82.55,22.86 PITOT_TUBE.3 | C12.1 46.35,17.14 L2.1 | R32.2 39.37,22.86 | RADIO.1 48.11,54.51 48.11,48.41 42.88,43.18 v40.64,43.18 | 39.37,22.86 38.1,24.13 DIP_SWITCH.12 | 39.37,22.86 46.99,22.86 GREEN.1
  pour Bottom: 0,80.01 100.33,80.01 100.33,0 0,0
AUX_DATA
  Top 0.152: AUX_DATA.1 72.39,58.42 TEENSY4.1.9-OUT1C
B_LED
  Bottom 0.152: BLUE.1 49.53,22.86 TEENSY4.1.37-PWM
DIP1
  Top 0.152: TEENSY4.1.33-MCLK2 40.64,33.02 DIP_SWITCH.11 40.64,27.94 R37.2
DIP2
  Top 0.152: TEENSY4.1.34-RX8 43.18,33.02 DIP_SWITCH.10 43.18,27.94 R36.2
DIP3
  Top 0.152: TEENSY4.1.35-TX8 45.72,33.02 DIP_SWITCH.9 45.72,27.94 R34.2
DIP4
  Top 0.152: TEENSY4.1.36-PWM 48.26,33.02 DIP_SWITCH.8 48.26,27.94 R35.2
GND  (via drill 0.35)
  Top 0.152: R35.1 R34.1 R36.1 R37.1 38.1,19.05 | TEENSY4.1.GND3 62.23,31.75 | 62.23,31.75 52.07,31.75 50.8,30.48 DIP_SWITCH.7 50.8,28.9 46.99,25.09 R35.1 | U$2.GND 33.02,44.85 33.02,33.02 35.79,30.25 35.79,28.02 37.47,26.34 37.47,19.68 38.1,19.05 | BAROMETER.2 v91.44,30.48 | 69.85,12.91 70.48,13.55 IC2.3 | 59.69,12.91 69.85,12.91 | IC3.3 60.33,13.55 59.69,12.91 | IC1.7 81.92,10.58 81.28,11.22 74.93,11.22 | IC1.3 80.64,15.88 80.01,16.51 R51.1 77.26,16.51 73.66,12.91 | R35.1 46.99,17.78 49.53,15.24 R53.1 55.67,12.91 v57.15,12.91 59.27,12.91 | 59.27,12.91 59.69,12.91 | 59.27,12.91 58.42,12.07 58.42,10.79 59.27,9.95 60.96,9.95 61.59,9.31 IC3.7 61.59,7.64 v60.96,7.01 | 74.93,11.22 73.47,9.76 72.58,9.76 71.75,8.93 IC2.7 71.75,8.26 73.66,6.35 C14.2 22V_GND.TP | R22.1 R21.1 | SV15.3 SV8.3 SV12.3 SV1.3 SV14.3 SV13.3 SV7.3 SV10.3 2.54,29.21 3.4,28.36 SERVO_DRIVER.14 3.54,28.19 3.54,27.48 5.62,25.4 v7.62,25.4 | C11.2 45.72,3.81 SV6.3 SV9.3 SV3.3 SV4.3 SV5.3 SV2.3 SV16.3 SV11.3 | PITOT_TUBE.2 71.12,24.13 PTR2.1 67.08,25.63 67.08,30.4 66.47,31.01 62.97,31.01 62.23,31.75 | v87.63,24.13 88.9,24.13 BAROMETER.2 | 74.93,11.22 73.66,12.49 73.66,12.91 | 69.85,12.91 73.66,12.91 | SERVO_DRIVER.25 10.04,22.32 10.04,21.61 11.33,20.32 v11.43,20.32 C10.2 | R1.2 38.1,19.05 | GPSMTK3339.GND 98.32,64.24 98.32,51.64 97.79,51.1 TEENSY4.1.GND1 97.79,45.72 96.52,44.45 96.52,35.56 TEENSY4.1.GND6 | JUMPER_TO_NAV.1 91.44,21.59 BAROMETER.2
  Bottom 0.152: TEENSY4.1.GND6 v91.44,30.48 | RADIO.2 46.34,58.17 U$2.GND | R1.2 R23.2 27.94,19.05 R22.1 | PITOT_TUBE.2 v87.63,24.13 | v7.62,25.4 11.43,21.59 v11.43,20.32 | C10.2 17.93,21.74 19.51,21.74 20.63,22.86 R21.1 | R24.1 73.66,20.32 71.12,22.86 PTR2.1 | C12.2 44.45,15.24 R34.1 | C11.2 55.88,5.08 57.15,6.35 v57.15,12.91 | C13.2 v60.96,7.01
  pour Top: 0,80.01 100.33,80.01 100.33,0 0,0
GPS_EN
  Top 0.152: TEENSY4.1.4-BCLK2 86.36,48.26 90.36,48.26 91.44,49.34 91.44,49.41 91.44,49.53 91.44,52.07 93.98,54.61 93.98,57.15 92.71,58.42 GPSMTK3339.EN
GPS_FIX
  Top 0.152: TEENSY4.1.2-OUT2 88.9,50.8 88.9,62.23 90.17,63.5 GPSMTK3339.FIX
GPS_PPS
  Top 0.152: TEENSY4.1.3-LRCLK2 87.63,74.93 88.9,76.2 GPSMTK3339.PPS
IMU_INT
  Top 0.152: U$2.INT 36.19,45.72 55.88,45.72 57.15,44.45 TEENSY4.1.40-A16/CS1
MISO1  (via drill 0.35)
  Top 0.152: TEENSY4.1.39-A15/CS/OUT1A v54.61,44.8
  Bottom 0.152: v54.61,44.8 54.61,48.07 53.34,49.34 53.34,57.89 51.54,59.69 51.54,63.78 RADIO.6
MOSI1
  Top 0.152: TEENSY4.1.26-A12/MOSI1 50.8,53.34 50.8,69.85 49.78,70.87 RADIO.7
N$1
  Top 0.152: DIP_SWITCH.4 RED.2
N$2
  Top 0.152: SV3.1 R14.2
N$3
  Top 0.152: DIP_SWITCH.5 BLUE.2
N$4
  Bottom 0.152: PTR1.2 78.74,26.67 PITOT_TUBE.1
N$5  (via drill 0.35)
  Top 0.305: C14.1 78.74,3.81
  Top 0.61: 22V_INPUT.TP 81.28,3.81 83.19,5.71 IC1.8 | 22V_INPUT.TP C14.1 | 22V_INPUT.TP 78.74,3.81 v74.93,7.62 74.12,7.62 IC2.8 | v67.31,7.62 67.18,7.62 66.09,8.72 66.04,8.72 IC3.8
  Bottom 0.61: v74.93,7.62 v67.31,7.62
N$6  (via drill 0.35)
  Top 0.203: v57.15,16.41 62.23,16.41 62.87,15.78 IC3.1
  Bottom 0.152: 49.53,8.89 L2.2
  Bottom 0.203: v57.15,16.41 51.97,16.41 49.53,13.97 49.53,8.89
N$7
  Top 0.152: DIP_SWITCH.6 GREEN.2
N$8
  Top 0.305: L6.2 85.72,17.95 IC1.1
N$9
  Top 0.152: IC1.5 79.38,8.26 R50.1 R51.2
N$10
  Top 0.152: DIP_SWITCH.3 YELLOW.2
N$11
  Top 0.152: DIP_SWITCH.2 WHITE.2
N$12
  Top 0.152: L1.2 71.75,15.88 73.03,14.61 IC2.1
N$14  (via drill 0.35)
  Top 0.152: v25.4,26.67 24.43,25.7 11.3,25.7 9.24,23.65 SERVO_DRIVER.24 | v29.21,26.67 R23.1
  Bottom 0.152: v29.21,26.67 v25.4,26.67
N$15  (via drill 0.35)
  Top 0.152: v25.4,27.94 24.13,26.67 11.43,26.67 8.6,23.84 SERVO_DRIVER.23 | v29.21,27.94 33.02,27.94 R1.1
  Bottom 0.152: v29.21,27.94 v25.4,27.94
N$16
  Top 0.152: ORANGE.2 DIP_SWITCH.1
N$18
  Top 0.152: IC3.5 59.05,8.26 58.42,7.62 R52.1 R53.2
N$19  (via drill 0.35)
  Top 0.152: R24.2 72.39,20.32 R25.1 | v67.31,11.43 67.31,10.16 68.75,8.72 IC2.5
  Bottom 0.152: v67.31,11.43 67.31,12.7 72.39,17.78 R25.1
N$43
  Top 0.152: SV16.1 17.78,7.62 16.36,9.04 14.78,9.04 12.7,11.12 R10.2
N$72
  Top 0.152: SERVO_DRIVER.5 9.24,29.21 12.55,32.51 18.16,32.51 18.56,32.11 22.5,32.11 R22.2
N$73
  Top 0.152: SERVO_DRIVER.4 9.89,29.05 13.06,32.21 17.75,32.21 18.36,31.6 19.51,31.6 20.63,30.48 R21.2
N$74
  Top 0.152: R20.1 17.78,31.75 17.68,31.85 17.63,31.9 13.38,31.9 10.54,29.07 SERVO_DRIVER.3
N$75
  Top 0.152: SERVO_DRIVER.2 11.2,29.21 11.2,29.29 13.51,31.6 14.43,31.6 15.55,30.48 R19.1
N$76
  Top 0.152: SERVO_DRIVER.1 11.85,28.36 R18.1
N$81
  Top 0.152: SV13.1 R6.2
N$82
  Top 0.152: SV15.1 R4.2
N$85
  Top 0.152: SV8.1 R3.2
N$88
  Top 0.152: SV7.1 R7.2
N$91
  Top 0.152: R11.2 22.86,8.89 SV2.1
N$94
  Top 0.152: SV1.1 R15.2
N$97
  Top 0.152: SV12.1 R2.2
N$100
  Top 0.152: SV14.1 R5.2
N$105
  Top 0.152: SV11.1 13.97,8.89 R9.2
N$108
  Top 0.152: SV10.1 R8.2
N$109
  Top 0.152: SV5.1 26.67,8.89 26.67,11.43 R12.2
N$112
  Top 0.152: SV9.1 R16.2
N$115
  Top 0.152: SV6.1 43.18,8.89 43.18,15.24 R17.2
N$118
  Top 0.152: SV4.1 31.75,12.7 R13.2
O_LED
  Bottom 0.152: ORANGE.1 63.5,20.63 70.81,27.94 86.36,27.94 90.17,31.75 TEENSY4.1.23-A9/CRX1/MCLK1
OUTPUT_BUCK1  (via drill 0.35)
  Top 0.61: 6V1.1 50.8,1.27 60.96,1.27 C13.1 | v36.22,21.59 v36.22,24.13
  Bottom 0.61: SV15.2 SV8.2 SV12.2 SV1.2 SV14.2 SV13.2 SV7.2 SV10.2 5.08,41.28 8.57,37.78 25.72,37.78 30.56,32.94 30.56,32.34 36.22,26.67 v36.22,24.13 | v36.22,21.59 36.22,19.66 49.53,6.35 6V1.1 | R50.2 84.79,9.19 84.79,15.54 81.28,19.05 L6.1 76.83,17.78 69.21,10.16 67.31,10.16 63.5,6.35 C13.1
OUTPUT_BUCK2
  Top 0.61: SV11.2 SV16.2 SV2.2 SV5.2 SV4.2 SV3.2 SV9.2 SV6.2 55.3,5.08 55.34,5.12 57.11,5.12 C11.1
  Bottom 0.61: L1.1 6V2.1 64.82,1.32 60.91,1.32 C11.1 58.42,16.43 59.69,17.7 67.23,17.7 R25.2
PIN0
  Top 0.152: TEENSY4.1.0-RX1/CS1/CRX2 95.25,53.34 UNUSED_PINS.2
PIN1
  Top 0.152: TEENSY4.1.1-TX1/MISO1/CTX2 92.71,52.07 94.72,54.08 94.72,55.35 UNUSED_PINS.1
PIN5
  Top 0.152: TEENSY4.1.5-IN2 82.55,52.07 59.69,74.93 59.69,76.2 UNUSED_PINS1.2
PIN6
  Top 0.152: TEENSY4.1.6-OUT1D 80.01,53.34 UNUSED_PINS1.1
PIN10
  Top 0.152: MORE_UNUSED.5 69.85,57.15 TEENSY4.1.10-CS\MQSR
PIN11
  Top 0.152: TEENSY4.1.11-MOSI/CTX1 67.31,57.15 MORE_UNUSED.4
PIN12
  Top 0.152: MORE_UNUSED.3 64.77,57.15 TEENSY4.1.12-MISO/MQSL
PIN13
  Top 0.152: TEENSY4.1.13-SCK/LED 69.22,29.84 81.28,29.84 85.75,25.37 85.75,20.48 86.75,19.48 86.75,18.62 86.36,18.23 86.36,9.2 87.48,8.08 87.48,7.77 UNUSED_PIN.4
PIN14
  Top 0.152: TEENSY4.1.14-A0/TX3/SPDIF_OUT 71.37,30.23 81.53,30.23 86.06,25.7 86.06,20.62 87.37,19.31 87.37,18.41 87.02,18.05 87.02,10.77 UNUSED_PIN.3
PIN16
  Top 0.152: TEENSY4.1.16-A2/RX4/SCL1 75.84,30.84 83.46,30.84 86.67,27.63 86.67,21.19 88.34,19.52 88.34,11.99 UNUSED_PIN.2
PIN17
  Top 0.152: TEENSY4.1.17-A3/TX4/SDA1 78.08,31.14 84.43,31.14 86.97,28.6 86.97,21.32 90.17,18.12 UNUSED_PIN.1
PIN24
  Top 0.152: TEENSY4.1.24-A10/TX6/SCL2 59.69,59.69 MORE_UNUSED.2
PIN25
  Top 0.152: TEENSY4.1.25-A11/RX6/SDA2 57.15,58.42 57.15,59.69 MORE_UNUSED.1
PIN29
  Top 0.152: TEENSY4.1.29-TX7 43.18,53.34 43.18,69.85 36.83,76.2 UNUSED_PINS3.3
PIN31
  Top 0.152: UNUSED_PINS3.2 15.24,75.23 16.08,74.4 37.36,74.4 41.91,69.85 TEENSY4.1.31-CTX3
PT_ANLGPIN  (via drill 0.35)
  Top 0.152: PTR1.1 67.39,27.86 67.39,30.53 66.6,31.32 63.93,31.32 v63.5,31.75
  Bottom 0.152: PTR1.1 71.12,24.13 76.2,24.13 PTR2.2 | TEENSY4.1.41-A17/MISO1 62.23,31.75 v63.5,31.75
PWM0
  Top 0.152: R4.1 19.81,67.82 19.81,53.34 19.81,52.81 15.54,48.54 15.54,41.78 12.8,39.04 12.8,38.28 11.05,36.52 9.56,36.52 8.6,35.56 SERVO_DRIVER.6
PWM1
  Top 0.152: R3.1 19.05,64.77 19.05,61.39 19.51,60.93 19.51,52.94 15.24,48.67 15.24,41.91 12.5,39.17 12.5,38.4 10.93,36.83 8.89,36.83 7.95,35.88 SERVO_DRIVER.7
PWM2
  Top 0.152: R2.1 19.2,60.81 19.2,53.06 14.43,48.29 14.43,41.94 12.19,39.7 12.19,38.53 11.76,38.1 11.6,37.93 11,37.34 8.56,37.34 7.57,36.35 7.57,31.25 7.29,30.97 SERVO_DRIVER.8
PWM3
  Top 0.152: SERVO_DRIVER.9 6.64,30.75 7.26,31.37 7.26,36.47 8.43,37.64 10.88,37.64 11.89,38.66 11.89,39.83 14.12,42.06 14.12,48.41 18.9,53.19 18.9,54.03 18.9,54.61 18.9,57.3 R15.1
PWM4
  Top 0.152: R5.1 17.78,53.34 13.82,49.38 13.82,42.72 11.58,40.48 11.58,38.78 10.75,37.95 8.08,37.95 6.96,36.83 6.96,31.5 6,30.53 SERVO_DRIVER.10
PWM5
  Top 0.152: R6.1 11.28,41.76 11.28,38.91 10.62,38.25 7.77,38.25 6.66,37.13 6.66,31.62 5.34,30.31 SERVO_DRIVER.11
PWM6
  Top 0.152: R7.1 7.62,39.37 6.35,38.1 6.35,31.75 4.7,30.09 SERVO_DRIVER.12
PWM7
  Top 0.152: R8.1 4.04,31.52 SERVO_DRIVER.13
PWM8
  Top 0.152: SERVO_DRIVER.15 3.4,10.57 R9.1
PWM9
  Top 0.152: R10.1 4.04,12.46 SERVO_DRIVER.16
PWM10
  Top 0.152: SERVO_DRIVER.17 4.7,14.36 5.08,13.97 13.97,13.97 15.24,12.7 R11.1
PWM11
  Top 0.152: R12.1 15.67,12.7 14.1,14.28 6.04,14.28 5.34,14.97 SERVO_DRIVER.18
PWM12
  Top 0.152: SERVO_DRIVER.19 6,19.41 10.82,14.58 14.22,14.58 14.83,13.97 26.67,13.97 27.94,12.7 27.94,11.43 R14.1
PWM13
  Top 0.152: R13.1 11.43,15.24 6.64,20.02 SERVO_DRIVER.20
PWM14
  Top 0.152: R16.1 33.02,13.97 30.48,16.51 11.43,16.51 7.29,20.64 SERVO_DRIVER.21
PWM15
  Top 0.152: R17.1 33.02,17.78 11.43,17.78 7.95,21.27 SERVO_DRIVER.22
R_LED
  Bottom 0.152: RED.1 58.42,21.59 62.23,21.59 71.12,30.48 81.28,30.48 82.55,31.75 TEENSY4.1.20-A6/TX5/LRCLK1
RADIO_CS  (via drill 0.35)
  Top 0.152: v53.34,43.18 53.34,35.56 TEENSY4.1.38-A14/CS/IN1 | v49.84,68.37 49.84,53.34 53.34,49.84 v53.34,47.6
  Bottom 0.152: v53.34,47.6 v53.34,43.18 | RADIO.8 47.24,73.41 49.84,70.81 v49.84,68.37
RADIO_EN  (via drill 0.35)
  Top 0.152: TEENSY4.1.32-OUT1B v39.37,53.34
  Bottom 0.152: v39.37,53.34 39.37,54.61 45.47,60.71 RADIO.3
RADIO_INT  (via drill 0.35)
  Top 0.152: v44.45,53.34 v44.45,60.96
  Bottom 0.152: TEENSY4.1.30-CRX3 v44.45,53.34 | v44.45,60.96 46.74,63.25 RADIO.4
RADIO_RST
  Top 0.152: RADIO.9 46.74,75.95 45.72,74.93 45.72,53.34 TEENSY4.1.28-RX7
RX2
  Bottom 0.152: TEENSY4.1.7-RX2/OUT1A 77.47,55.88 87.63,66.04 GPSMTK3339.TX
SCK1
  Top 0.152: RADIO.5 48.51,65.79 49.53,64.77 49.53,52.07 TEENSY4.1.27-A13/SCK1
SCL  (via drill 0.35)
  Top 0.152: BAROMETER.4 96.52,27.94 92.71,31.75 82.55,31.75 TEENSY4.1.19-A5/SCL0 | SERVO_DRIVER.26 10.54,24.52 11.43,25.4 25.4,25.4 26.67,26.67 R33.2 26.67,35.56 v31.75,40.64 | SCL.1 96.52,21.59 96.52,12.7 95.25,11.43 JUMPER_TO_NAV.4
  Bottom 0.152: TEENSY4.1.19-A5/SCL0 80.01,35.56 74.93,40.64 49.53,40.64 48.51,41.66 U$2.SCL 32.77,41.66 v31.75,40.64 | BAROMETER.4 96.52,24.13 SCL.1
SDA  (via drill 0.35)
  Top 0.152: SERVO_DRIVER.27 11.2,23.89 11.43,24.13 26.67,24.13 27.33,24.79 27.33,28.19 29.21,30.07 R32.1 29.21,35.56 v31.75,38.1 | TEENSY4.1.18-A4/SDA0 80.31,31.45 92.58,31.45 93.98,30.05 BAROMETER.3
  Bottom 0.152: TEENSY4.1.18-A4/SDA0 77.47,35.56 75.17,37.86 49.77,37.86 48.47,39.16 U$2.SDA 32.81,39.16 v31.75,38.1 | BAROMETER.3 93.98,24.13 SDA.1 97.79,16.51 95.25,13.97 JUMPER_TO_NAV.3
SELECT_PIN  (via drill 0.35)
  Top 0.152: TEENSY4.1.15-A1/RX3/SPDIF_IN 73.61,30.53 81.66,30.53 86.36,25.83 86.36,21.07 87.68,19.75 v87.68,17.78
  Bottom 0.152: JUMPER_TO_NAV.2 88.9,16.51 87.68,17.73 v87.68,17.78
TX2
  Bottom 0.152: TEENSY4.1.8-TX2/IN1 74.93,64.77 78.74,68.58 GPSMTK3339.RX
W_LED
  Bottom 0.152: WHITE.1 61.27,19.05 71.42,29.21 86.36,29.21 87.63,30.48 TEENSY4.1.22-A8/CTX1
Y_LED
  Bottom 0.152: YELLOW.1 59.69,20.32 62.1,20.32 71.3,29.52 83.82,29.52 85.09,30.79 TEENSY4.1.21-A7/RX5/BCLK1